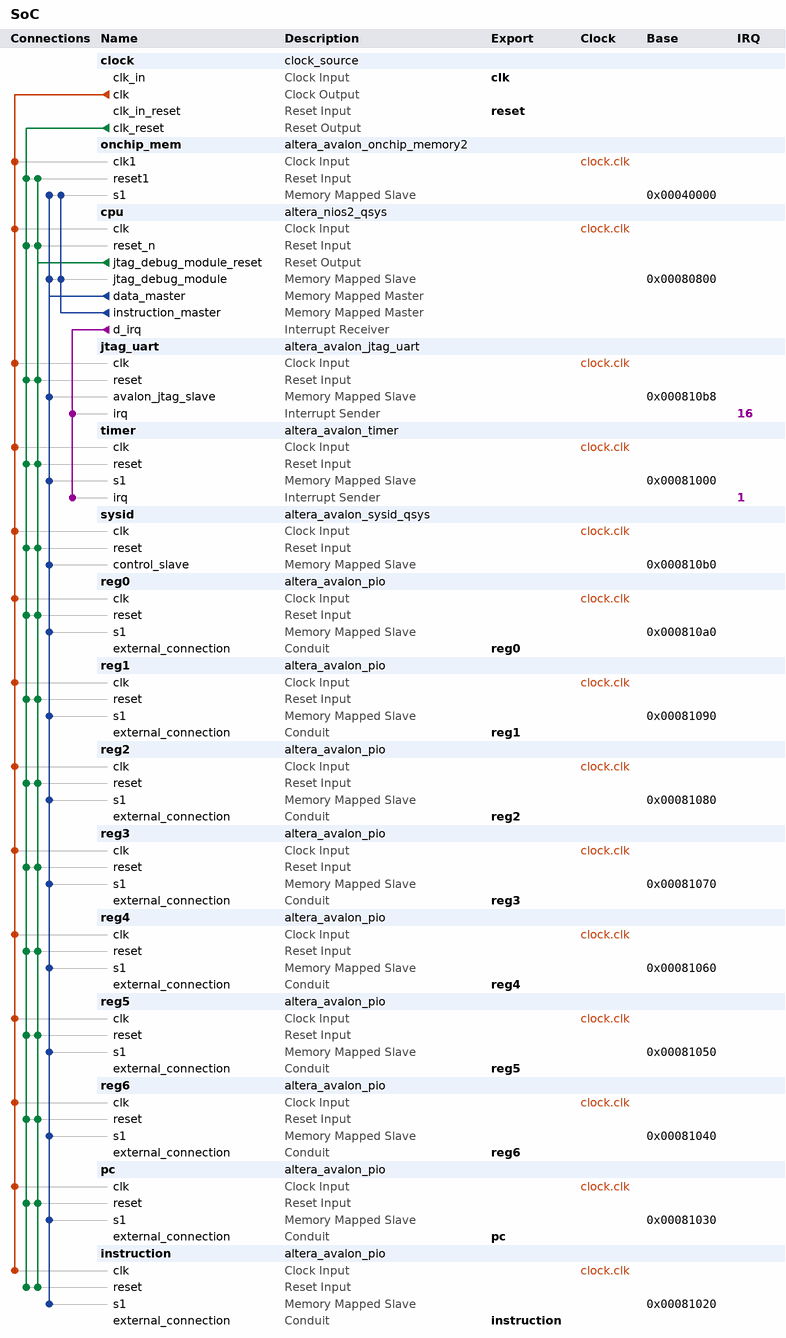
[diagram p0: system contents]
# Platform Designer (Qsys) system SoC, Cyclone IV E EP4CE115F29C7
# Parameters at their usual value, and those the tool derives, are not listed.
package require -exact qsys 12.1
create_system SoC
set_project_property DEVICE_FAMILY {Cyclone IV E}
set_project_property DEVICE EP4CE115F29C7

add_instance clock clock_source 12.1
set_instance_parameter_value clock clockFrequency 50000000

add_instance onchip_mem altera_avalon_onchip_memory2 12.1
set_instance_parameter_value onchip_mem dataWidth 32
set_instance_parameter_value onchip_mem dualPort false
set_instance_parameter_value onchip_mem initMemContent true
set_instance_parameter_value onchip_mem initializationFileName onchip_mem
set_instance_parameter_value onchip_mem memorySize 262144

add_instance cpu altera_nios2_qsys 12.1
set_instance_parameter_value cpu resetSlave onchip_mem.s1
set_instance_parameter_value cpu exceptionSlave onchip_mem.s1
set_instance_parameter_value cpu breakSlave cpu.jtag_debug_module
set_instance_parameter_value cpu muldiv_multiplierType NoneSmall
set_instance_parameter_value cpu impl Small
set_instance_parameter_value cpu icache_size 4096

add_instance jtag_uart altera_avalon_jtag_uart 12.1
set_instance_parameter_value jtag_uart simInteractiveOptions INTERACTIVE_ASCII_OUTPUT

add_instance timer altera_avalon_timer 12.1
set_instance_parameter_value timer period 1
set_instance_parameter_value timer periodUnits MSEC
set_instance_parameter_value timer timerPreset FULL_FEATURED

add_instance sysid altera_avalon_sysid_qsys 12.1
set_instance_parameter_value sysid id 0

add_instance reg0 altera_avalon_pio 12.1
set_instance_parameter_value reg0 direction Input
set_instance_parameter_value reg0 width 32

add_instance reg1 altera_avalon_pio 12.1
set_instance_parameter_value reg1 direction Input
set_instance_parameter_value reg1 width 32

add_instance reg2 altera_avalon_pio 12.1
set_instance_parameter_value reg2 direction Input
set_instance_parameter_value reg2 width 32

add_instance reg3 altera_avalon_pio 12.1
set_instance_parameter_value reg3 direction Input
set_instance_parameter_value reg3 width 32

add_instance reg4 altera_avalon_pio 12.1
set_instance_parameter_value reg4 direction Input
set_instance_parameter_value reg4 width 32

add_instance reg5 altera_avalon_pio 12.1
set_instance_parameter_value reg5 direction Input
set_instance_parameter_value reg5 width 32

add_instance reg6 altera_avalon_pio 12.1
set_instance_parameter_value reg6 direction Input
set_instance_parameter_value reg6 width 32

add_instance pc altera_avalon_pio 12.1
set_instance_parameter_value pc direction Input
set_instance_parameter_value pc width 32

add_instance instruction altera_avalon_pio 12.1
set_instance_parameter_value instruction direction Input
set_instance_parameter_value instruction width 32

# connections
add_connection clock.clk cpu.clk clock
add_connection clock.clk instruction.clk clock
add_connection clock.clk jtag_uart.clk clock
add_connection clock.clk onchip_mem.clk1 clock
add_connection clock.clk pc.clk clock
add_connection clock.clk reg0.clk clock
add_connection clock.clk reg1.clk clock
add_connection clock.clk reg2.clk clock
add_connection clock.clk reg3.clk clock
add_connection clock.clk reg4.clk clock
add_connection clock.clk reg5.clk clock
add_connection clock.clk reg6.clk clock
add_connection clock.clk sysid.clk clock
add_connection clock.clk timer.clk clock
add_connection clock.clk_reset cpu.reset_n reset
add_connection clock.clk_reset instruction.reset reset
add_connection clock.clk_reset jtag_uart.reset reset
add_connection clock.clk_reset onchip_mem.reset1 reset
add_connection clock.clk_reset pc.reset reset
add_connection clock.clk_reset reg0.reset reset
add_connection clock.clk_reset reg1.reset reset
add_connection clock.clk_reset reg2.reset reset
add_connection clock.clk_reset reg3.reset reset
add_connection clock.clk_reset reg4.reset reset
add_connection clock.clk_reset reg5.reset reset
add_connection clock.clk_reset reg6.reset reset
add_connection clock.clk_reset sysid.reset reset
add_connection clock.clk_reset timer.reset reset
add_connection cpu.jtag_debug_module_reset cpu.reset_n reset
add_connection cpu.jtag_debug_module_reset instruction.reset reset
add_connection cpu.jtag_debug_module_reset jtag_uart.reset reset
add_connection cpu.jtag_debug_module_reset onchip_mem.reset1 reset
add_connection cpu.jtag_debug_module_reset pc.reset reset
add_connection cpu.jtag_debug_module_reset reg0.reset reset
add_connection cpu.jtag_debug_module_reset reg1.reset reset
add_connection cpu.jtag_debug_module_reset reg2.reset reset
add_connection cpu.jtag_debug_module_reset reg3.reset reset
add_connection cpu.jtag_debug_module_reset reg4.reset reset
add_connection cpu.jtag_debug_module_reset reg5.reset reset
add_connection cpu.jtag_debug_module_reset reg6.reset reset
add_connection cpu.jtag_debug_module_reset sysid.reset reset
add_connection cpu.jtag_debug_module_reset timer.reset reset
add_connection cpu.data_master cpu.jtag_debug_module avalon
set_connection_parameter_value cpu.data_master/cpu.jtag_debug_module baseAddress 0x00080800
add_connection cpu.data_master instruction.s1 avalon
set_connection_parameter_value cpu.data_master/instruction.s1 baseAddress 0x00081020
add_connection cpu.data_master jtag_uart.avalon_jtag_slave avalon
set_connection_parameter_value cpu.data_master/jtag_uart.avalon_jtag_slave baseAddress 0x000810b8
add_connection cpu.data_master onchip_mem.s1 avalon
set_connection_parameter_value cpu.data_master/onchip_mem.s1 baseAddress 0x00040000
add_connection cpu.data_master pc.s1 avalon
set_connection_parameter_value cpu.data_master/pc.s1 baseAddress 0x00081030
add_connection cpu.data_master reg0.s1 avalon
set_connection_parameter_value cpu.data_master/reg0.s1 baseAddress 0x000810a0
add_connection cpu.data_master reg1.s1 avalon
set_connection_parameter_value cpu.data_master/reg1.s1 baseAddress 0x00081090
add_connection cpu.data_master reg2.s1 avalon
set_connection_parameter_value cpu.data_master/reg2.s1 baseAddress 0x00081080
add_connection cpu.data_master reg3.s1 avalon
set_connection_parameter_value cpu.data_master/reg3.s1 baseAddress 0x00081070
add_connection cpu.data_master reg4.s1 avalon
set_connection_parameter_value cpu.data_master/reg4.s1 baseAddress 0x00081060
add_connection cpu.data_master reg5.s1 avalon
set_connection_parameter_value cpu.data_master/reg5.s1 baseAddress 0x00081050
add_connection cpu.data_master reg6.s1 avalon
set_connection_parameter_value cpu.data_master/reg6.s1 baseAddress 0x00081040
add_connection cpu.data_master sysid.control_slave avalon
set_connection_parameter_value cpu.data_master/sysid.control_slave baseAddress 0x000810b0
add_connection cpu.data_master timer.s1 avalon
set_connection_parameter_value cpu.data_master/timer.s1 baseAddress 0x00081000
add_connection cpu.instruction_master cpu.jtag_debug_module avalon
set_connection_parameter_value cpu.instruction_master/cpu.jtag_debug_module baseAddress 0x00080800
add_connection cpu.instruction_master onchip_mem.s1 avalon
set_connection_parameter_value cpu.instruction_master/onchip_mem.s1 baseAddress 0x00040000
add_connection cpu.d_irq jtag_uart.irq interrupt
set_connection_parameter_value cpu.d_irq/jtag_uart.irq irqNumber 16
add_connection cpu.d_irq timer.irq interrupt
set_connection_parameter_value cpu.d_irq/timer.irq irqNumber 1

# exported interfaces
add_interface clk clock sink
set_interface_property clk EXPORT_OF clock.clk_in
add_interface reset reset sink
set_interface_property reset EXPORT_OF clock.clk_in_reset
add_interface reg0 conduit end
set_interface_property reg0 EXPORT_OF reg0.external_connection
add_interface reg1 conduit end
set_interface_property reg1 EXPORT_OF reg1.external_connection
add_interface reg6 conduit end
set_interface_property reg6 EXPORT_OF reg6.external_connection
add_interface reg5 conduit end
set_interface_property reg5 EXPORT_OF reg5.external_connection
add_interface reg4 conduit end
set_interface_property reg4 EXPORT_OF reg4.external_connection
add_interface reg3 conduit end
set_interface_property reg3 EXPORT_OF reg3.external_connection
add_interface reg2 conduit end
set_interface_property reg2 EXPORT_OF reg2.external_connection
add_interface pc conduit end
set_interface_property pc EXPORT_OF pc.external_connection
add_interface instruction conduit end
set_interface_property instruction EXPORT_OF instruction.external_connection

save_system SoC.qsys
